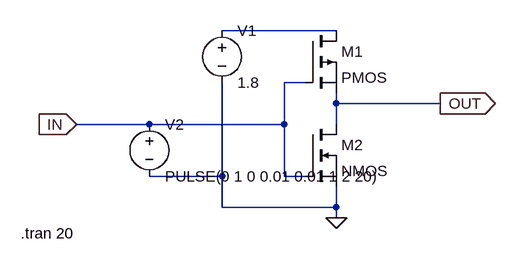
[diagram p0: schematic inverter.asc]
inverter.asc, the LTspice schematic file:
Version 4
SHEET 1 880 680
WIRE 176 32 0 32
WIRE 128 112 96 112
WIRE 176 144 176 128
WIRE 336 144 176 144
WIRE -112 176 -224 176
WIRE 96 176 96 112
WIRE 96 176 -112 176
WIRE 176 176 176 144
WIRE 0 256 0 112
WIRE 0 256 -112 256
WIRE 96 256 96 176
WIRE 128 256 96 256
WIRE 0 304 0 256
WIRE 176 304 176 272
WIRE 176 304 0 304
WIRE 176 320 176 304
FLAG 176 320 0
FLAG -224 176 IN
IOPIN -224 176 In
FLAG 336 144 OUT
IOPIN 336 144 Out
SYMBOL pmos 128 32 R0
SYMATTR InstName M1
SYMBOL nmos 128 176 R0
SYMATTR InstName M2
SYMBOL voltage 0 16 R0
WINDOW 123 0 0 Left 0
WINDOW 39 0 0 Left 0
SYMATTR InstName V1
SYMATTR Value 1.8
SYMBOL voltage -112 160 R0
WINDOW 123 0 0 Left 0
WINDOW 39 0 0 Left 0
SYMATTR InstName V2
SYMATTR Value PULSE(0 1 0 0.01 0.01 1 2 20)
TEXT -310 344 Left 2 !.tran 20

The netlist it stands for:
* inverter.asc
M1 N001 IN OUT OUT PMOS
M2 OUT IN 0 0 NMOS
V1 N001 0 1.8
V2 IN 0 PULSE(0 1 0 0.01 0.01 1 2 20)
.model NMOS NMOS
.model PMOS PMOS
.lib standard.mos
.tran 20
.backanno
.end